# EAGLE schematic PDM_2019_RevA (EAGLE 9.1.3)

## Sheet 1 of 4
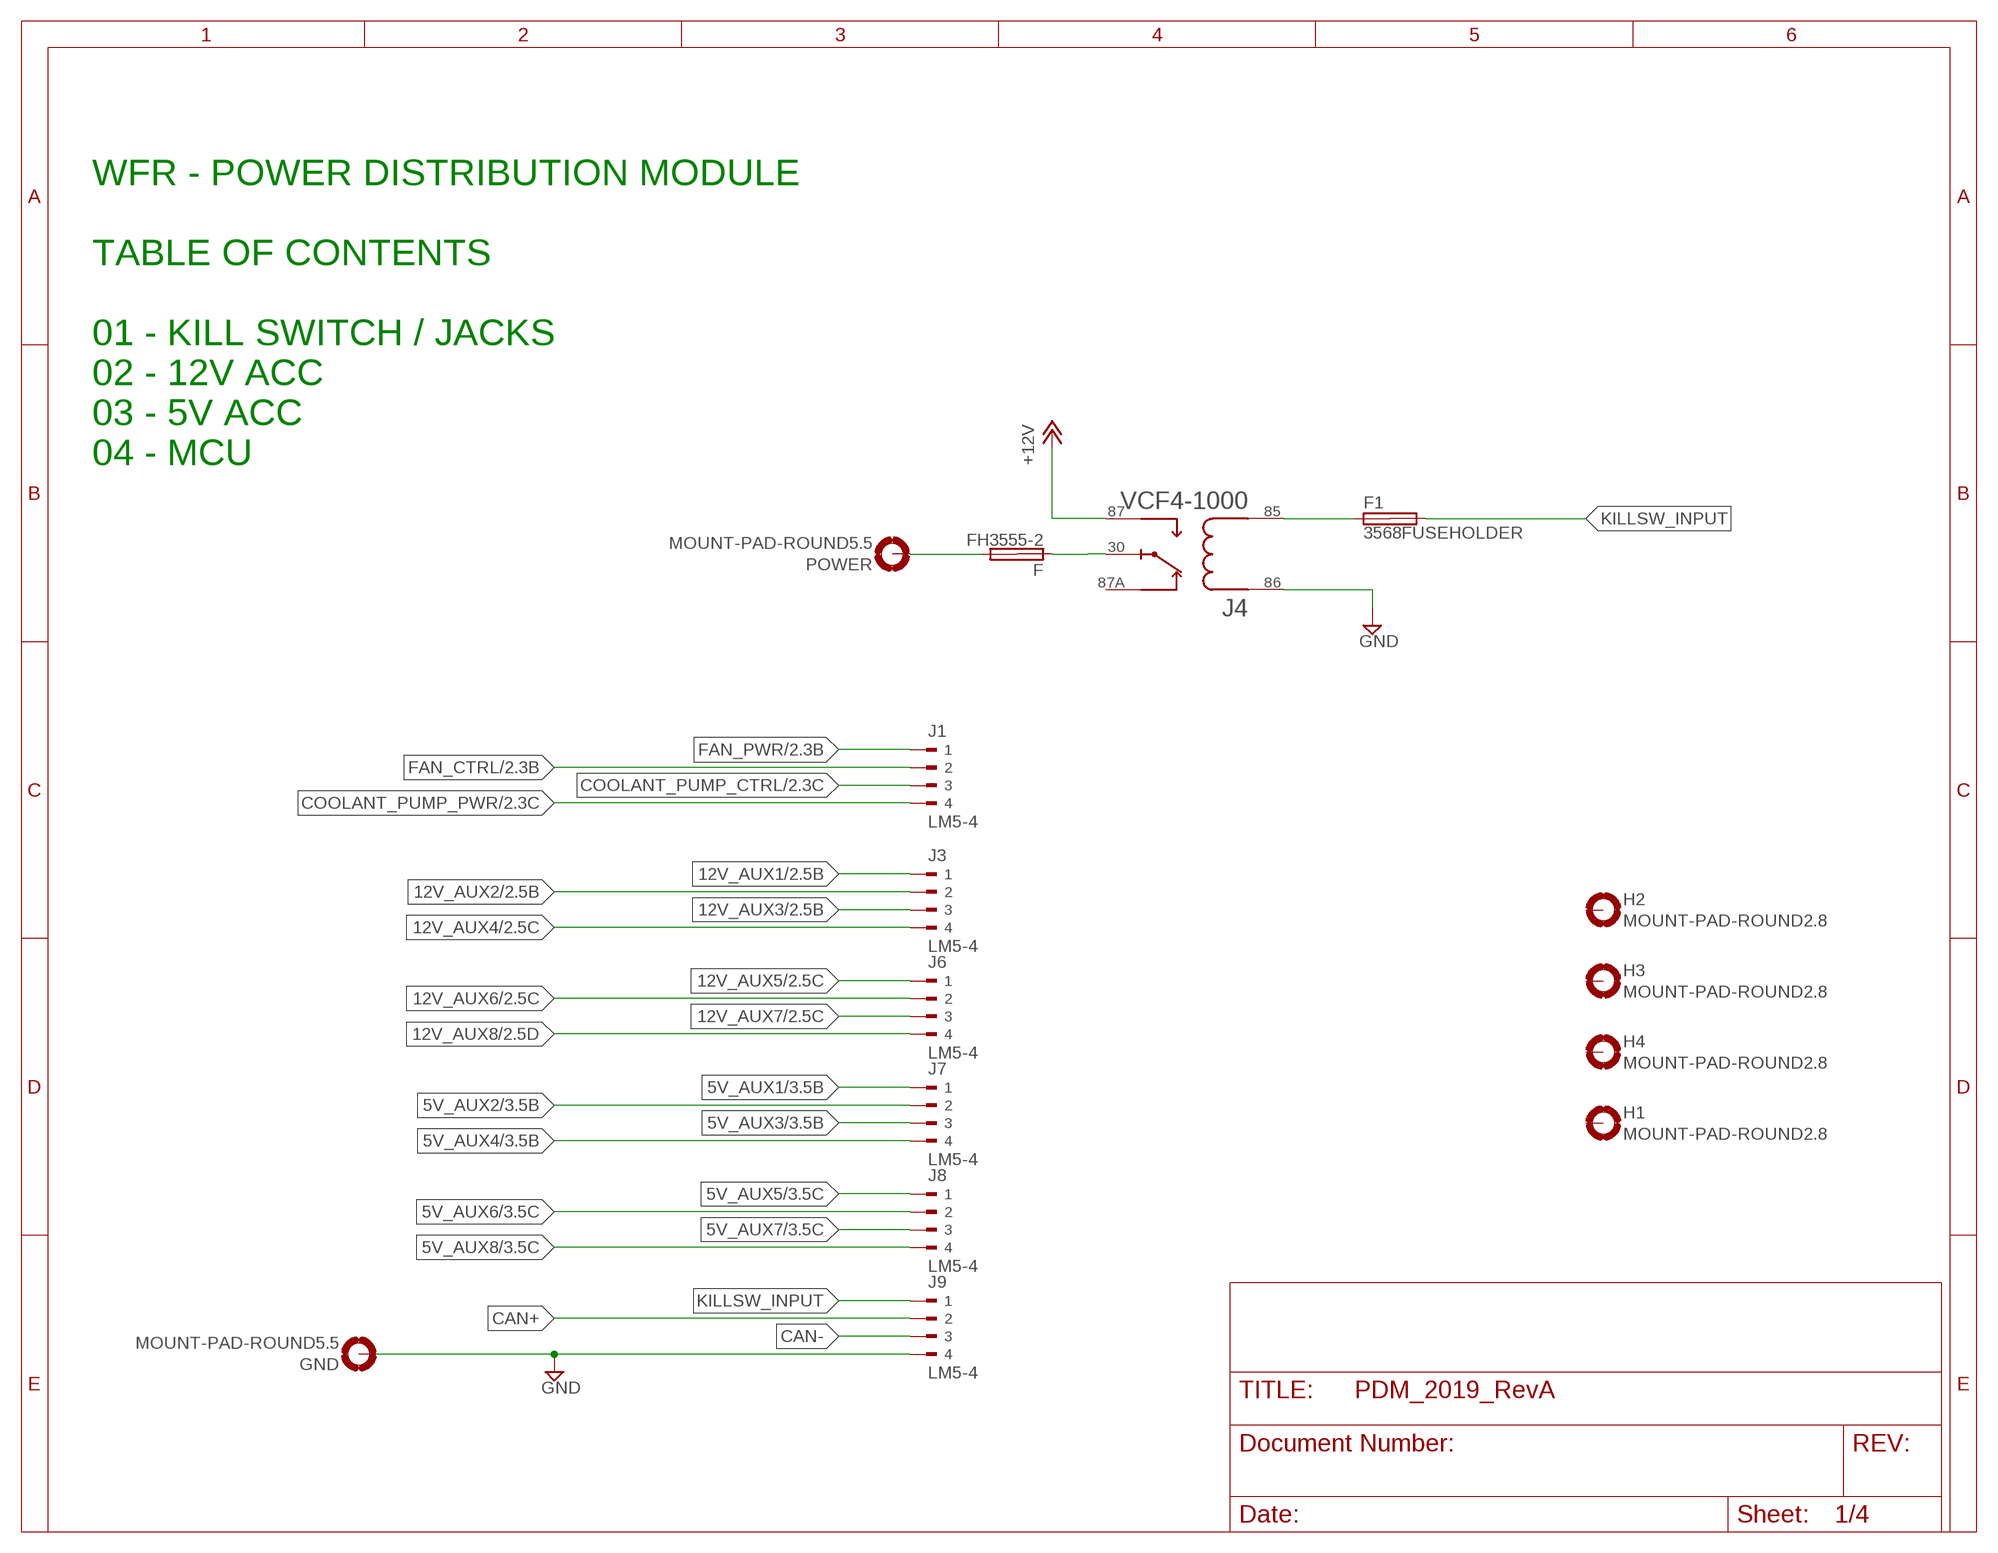
[diagram p0: schematic, sheet 1]

### Parts
F  FH3555-2  [3555-2]
F1  3568FUSEHOLDER  [3568]
GND  MOUNT-PAD-ROUND5.5  [5,5-PAD]
H1  MOUNT-PAD-ROUND2.8  [2,8-PAD]
H2  MOUNT-PAD-ROUND2.8  [2,8-PAD]
H3  MOUNT-PAD-ROUND2.8  [2,8-PAD]
H4  MOUNT-PAD-ROUND2.8  [2,8-PAD]
J1  LM5-4  [281-1423]
J3  LM5-4  [281-1423]
J4  VCF4-1000  [TE_VCF4-1000]
J6  LM5-4  [281-1423]
J7  LM5-4  [281-1423]
J8  LM5-4  [281-1423]
J9  LM5-4  [281-1423]
POWER  MOUNT-PAD-ROUND5.5  [5,5-PAD]

### Nets
5V_AUX1: J7.P$1 ; also sheet 3
5V_AUX2: J7.P$2 ; also sheet 3
5V_AUX3: J7.P$3 ; also sheet 3
5V_AUX4: J7.P$4 ; also sheet 3
5V_AUX5: J8.P$1 ; also sheet 3
5V_AUX6: J8.P$2 ; also sheet 3
5V_AUX7: J8.P$3 ; also sheet 3
5V_AUX8: J8.P$4 ; also sheet 3
12V_AUX1: J3.P$1 ; also sheet 2
12V_AUX2: J3.P$2 ; also sheet 2
12V_AUX3: J3.P$3 ; also sheet 2
12V_AUX4: J3.P$4 ; also sheet 2
12V_AUX5: J6.P$1 ; also sheet 2
12V_AUX6: J6.P$2 ; also sheet 2
12V_AUX7: J6.P$3 ; also sheet 2
12V_AUX8: J6.P$4 ; also sheet 2
+12V: J4.87 ; also sheet 2,3
CAN+: J9.P$2
CAN-: J9.P$3
COOLANT_PUMP_CTRL: J1.P$3 ; also sheet 2
COOLANT_PUMP_PWR: J1.P$4 ; also sheet 2
FAN_CTRL: J1.P$2 ; also sheet 2
FAN_PWR: J1.P$1 ; also sheet 2
GND: GND.B5,5(MOUNT) J4.86 J9.P$4 ; also sheet 2,3
KILLSW_INPUT: F1.R1(2A) J9.P$1
N$6: F1.L1(1A) J4.85
N$7: F.L1(1A) J4.30
N$8: F.R1(2A) POWER.B5,5(MOUNT)
Unconnected: F1.L2(1B) F1.R2(2B) F.L2(1B) F.R2(2B) H1.B2,8(MOUNT) H2.B2,8(MOUNT) H3.B2,8(MOUNT) H4.B2,8(MOUNT) J4.87A

### Notes on the sheet
- WFR - POWER DISTRIBUTION MODULE
  
  TABLE OF CONTENTS
  
  01 - KILL SWITCH / JACKS
  02 - 12V ACC
  03 - 5V ACC
  04 - MCU

## Sheet 2 of 4
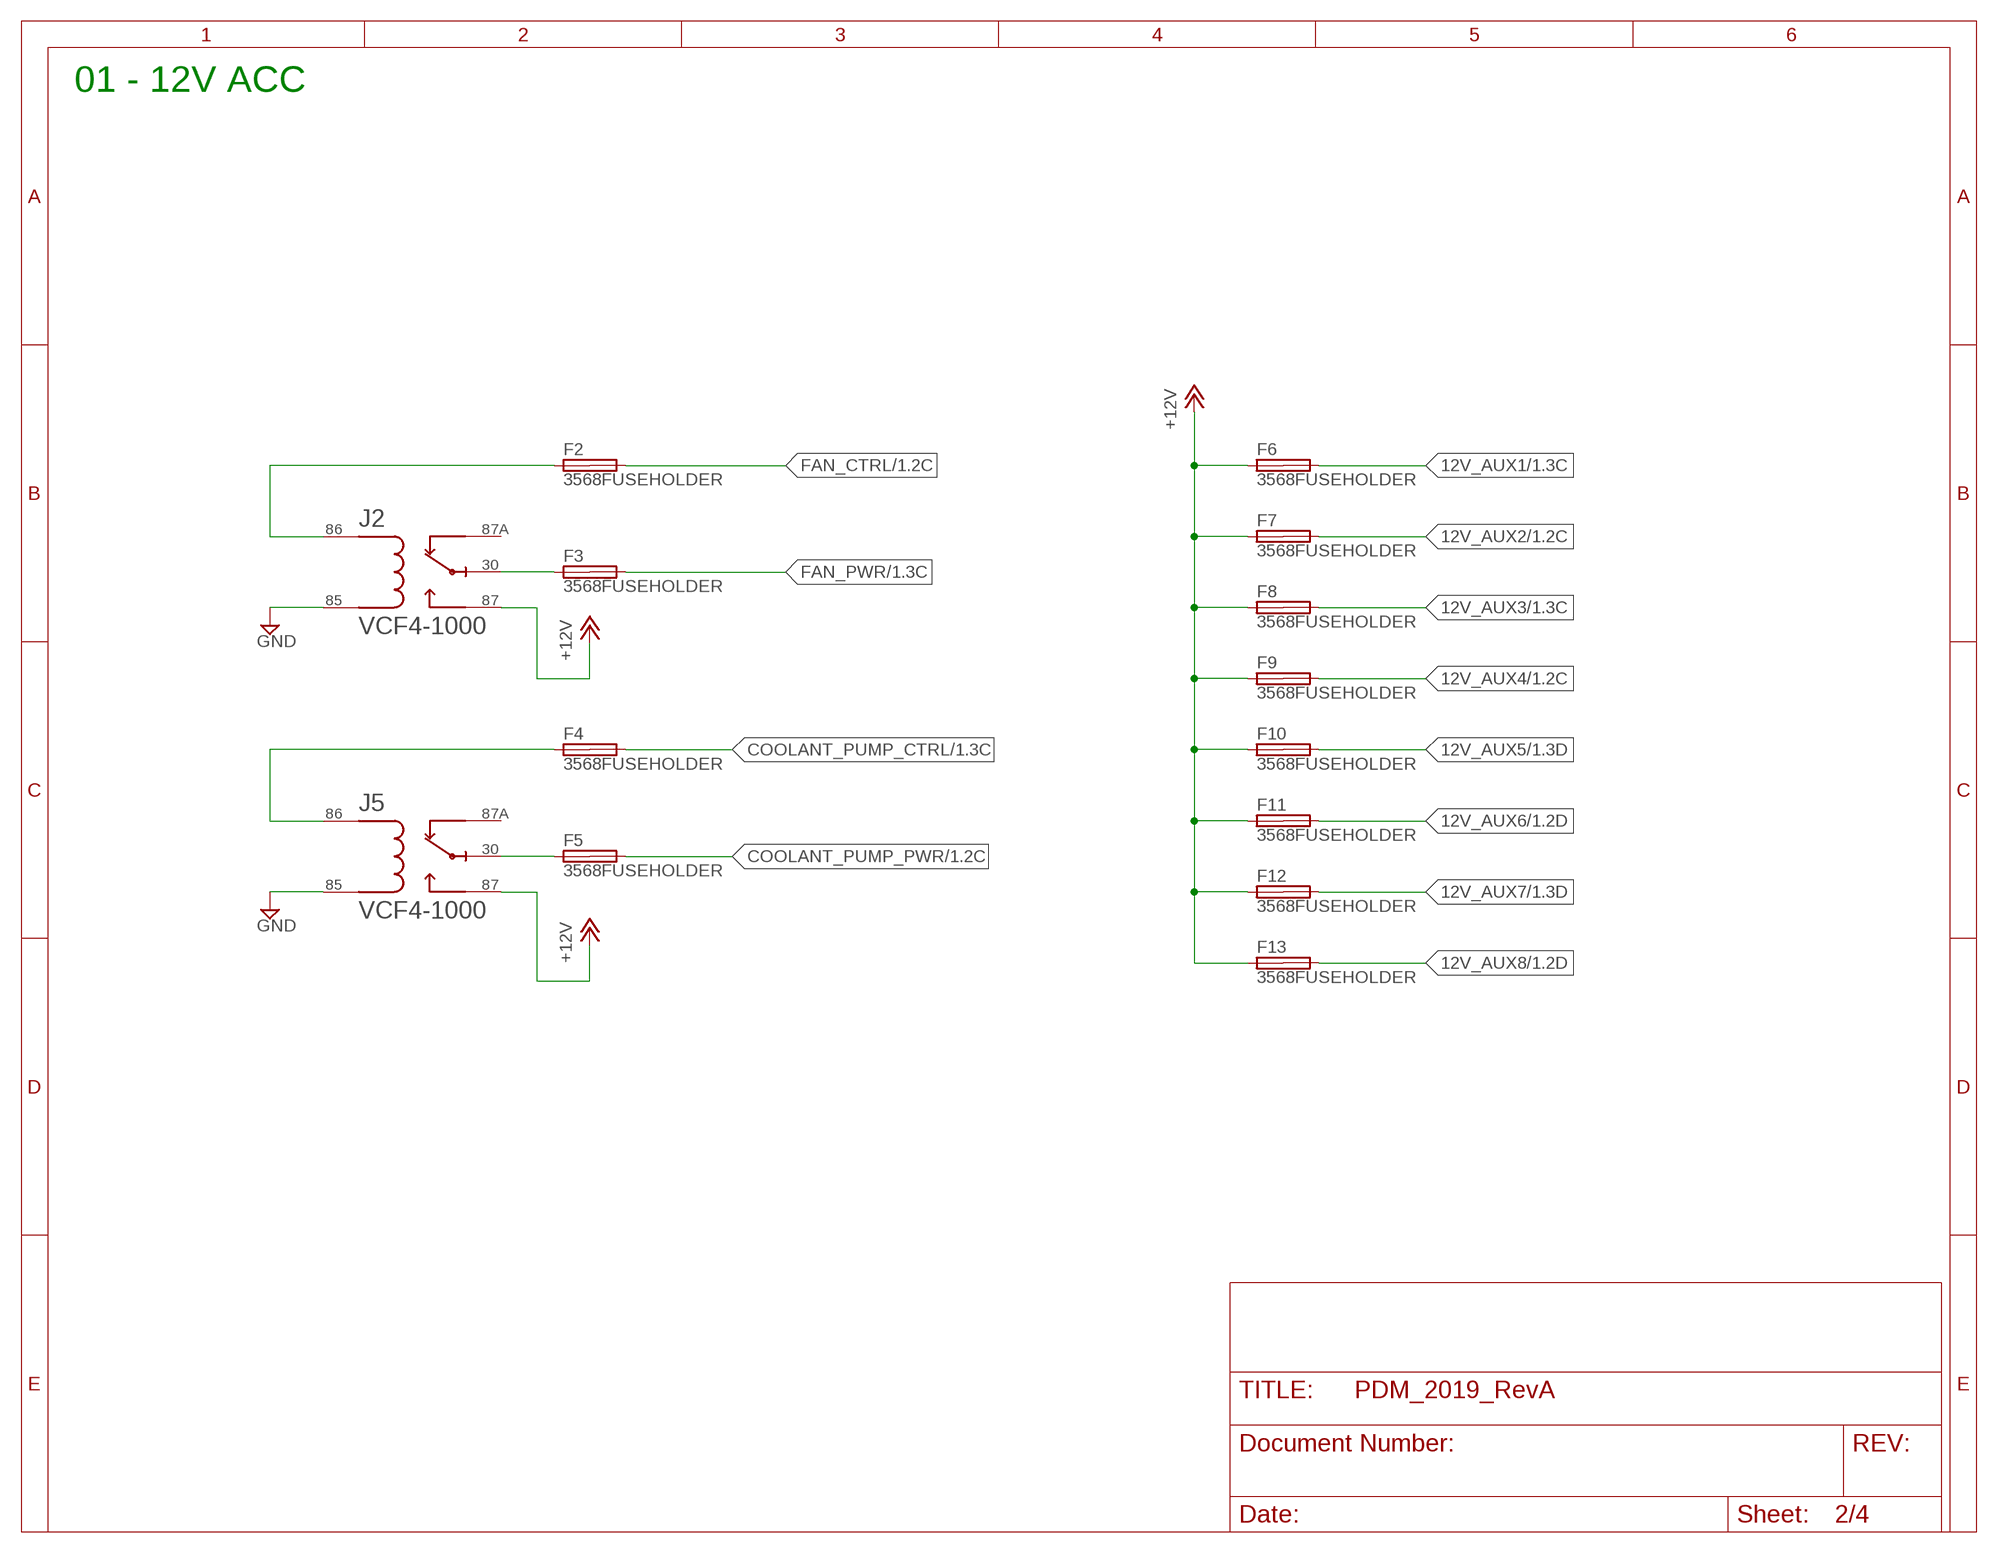
[diagram p1: schematic, sheet 2]

### Parts
F2  3568FUSEHOLDER  [3568]
F3  3568FUSEHOLDER  [3568]
F4  3568FUSEHOLDER  [3568]
F5  3568FUSEHOLDER  [3568]
F6  3568FUSEHOLDER  [3568]
F7  3568FUSEHOLDER  [3568]
F8  3568FUSEHOLDER  [3568]
F9  3568FUSEHOLDER  [3568]
F10  3568FUSEHOLDER  [3568]
F11  3568FUSEHOLDER  [3568]
F12  3568FUSEHOLDER  [3568]
F13  3568FUSEHOLDER  [3568]
J2  VCF4-1000  [TE_VCF4-1000]
J5  VCF4-1000  [TE_VCF4-1000]

### Nets
12V_AUX1: F6.R1(2A) ; also sheet 1
12V_AUX2: F7.R1(2A) ; also sheet 1
12V_AUX3: F8.R1(2A) ; also sheet 1
12V_AUX4: F9.R1(2A) ; also sheet 1
12V_AUX5: F10.R1(2A) ; also sheet 1
12V_AUX6: F11.R1(2A) ; also sheet 1
12V_AUX7: F12.R1(2A) ; also sheet 1
12V_AUX8: F13.R1(2A) ; also sheet 1
+12V: F6.L1(1A) F7.L1(1A) F8.L1(1A) F9.L1(1A) F10.L1(1A) F11.L1(1A) F12.L1(1A) F13.L1(1A) J2.87 J5.87 ; also sheet 1,3
COOLANT_PUMP_CTRL: F4.R1(2A) ; also sheet 1
COOLANT_PUMP_PWR: F5.R1(2A) ; also sheet 1
FAN_CTRL: F2.R1(2A) ; also sheet 1
FAN_PWR: F3.R1(2A) ; also sheet 1
GND: J2.85 J5.85 ; also sheet 1,3
N$5: F2.L1(1A) J2.86
N$9: F3.L1(1A) J2.30
N$10: F4.L1(1A) J5.86
N$11: F5.L1(1A) J5.30
Unconnected: F2.L2(1B) F2.R2(2B) F3.L2(1B) F3.R2(2B) F4.L2(1B) F4.R2(2B) F5.L2(1B) F5.R2(2B) F6.L2(1B) F6.R2(2B) F7.L2(1B) F7.R2(2B) F8.L2(1B) F8.R2(2B) F9.L2(1B) F9.R2(2B) F10.L2(1B) F10.R2(2B) F11.L2(1B) F11.R2(2B) F12.L2(1B) F12.R2(2B) F13.L2(1B) F13.R2(2B) J2.87A J5.87A

### Notes on the sheet
- 01 - 12V ACC

## Sheet 3 of 4
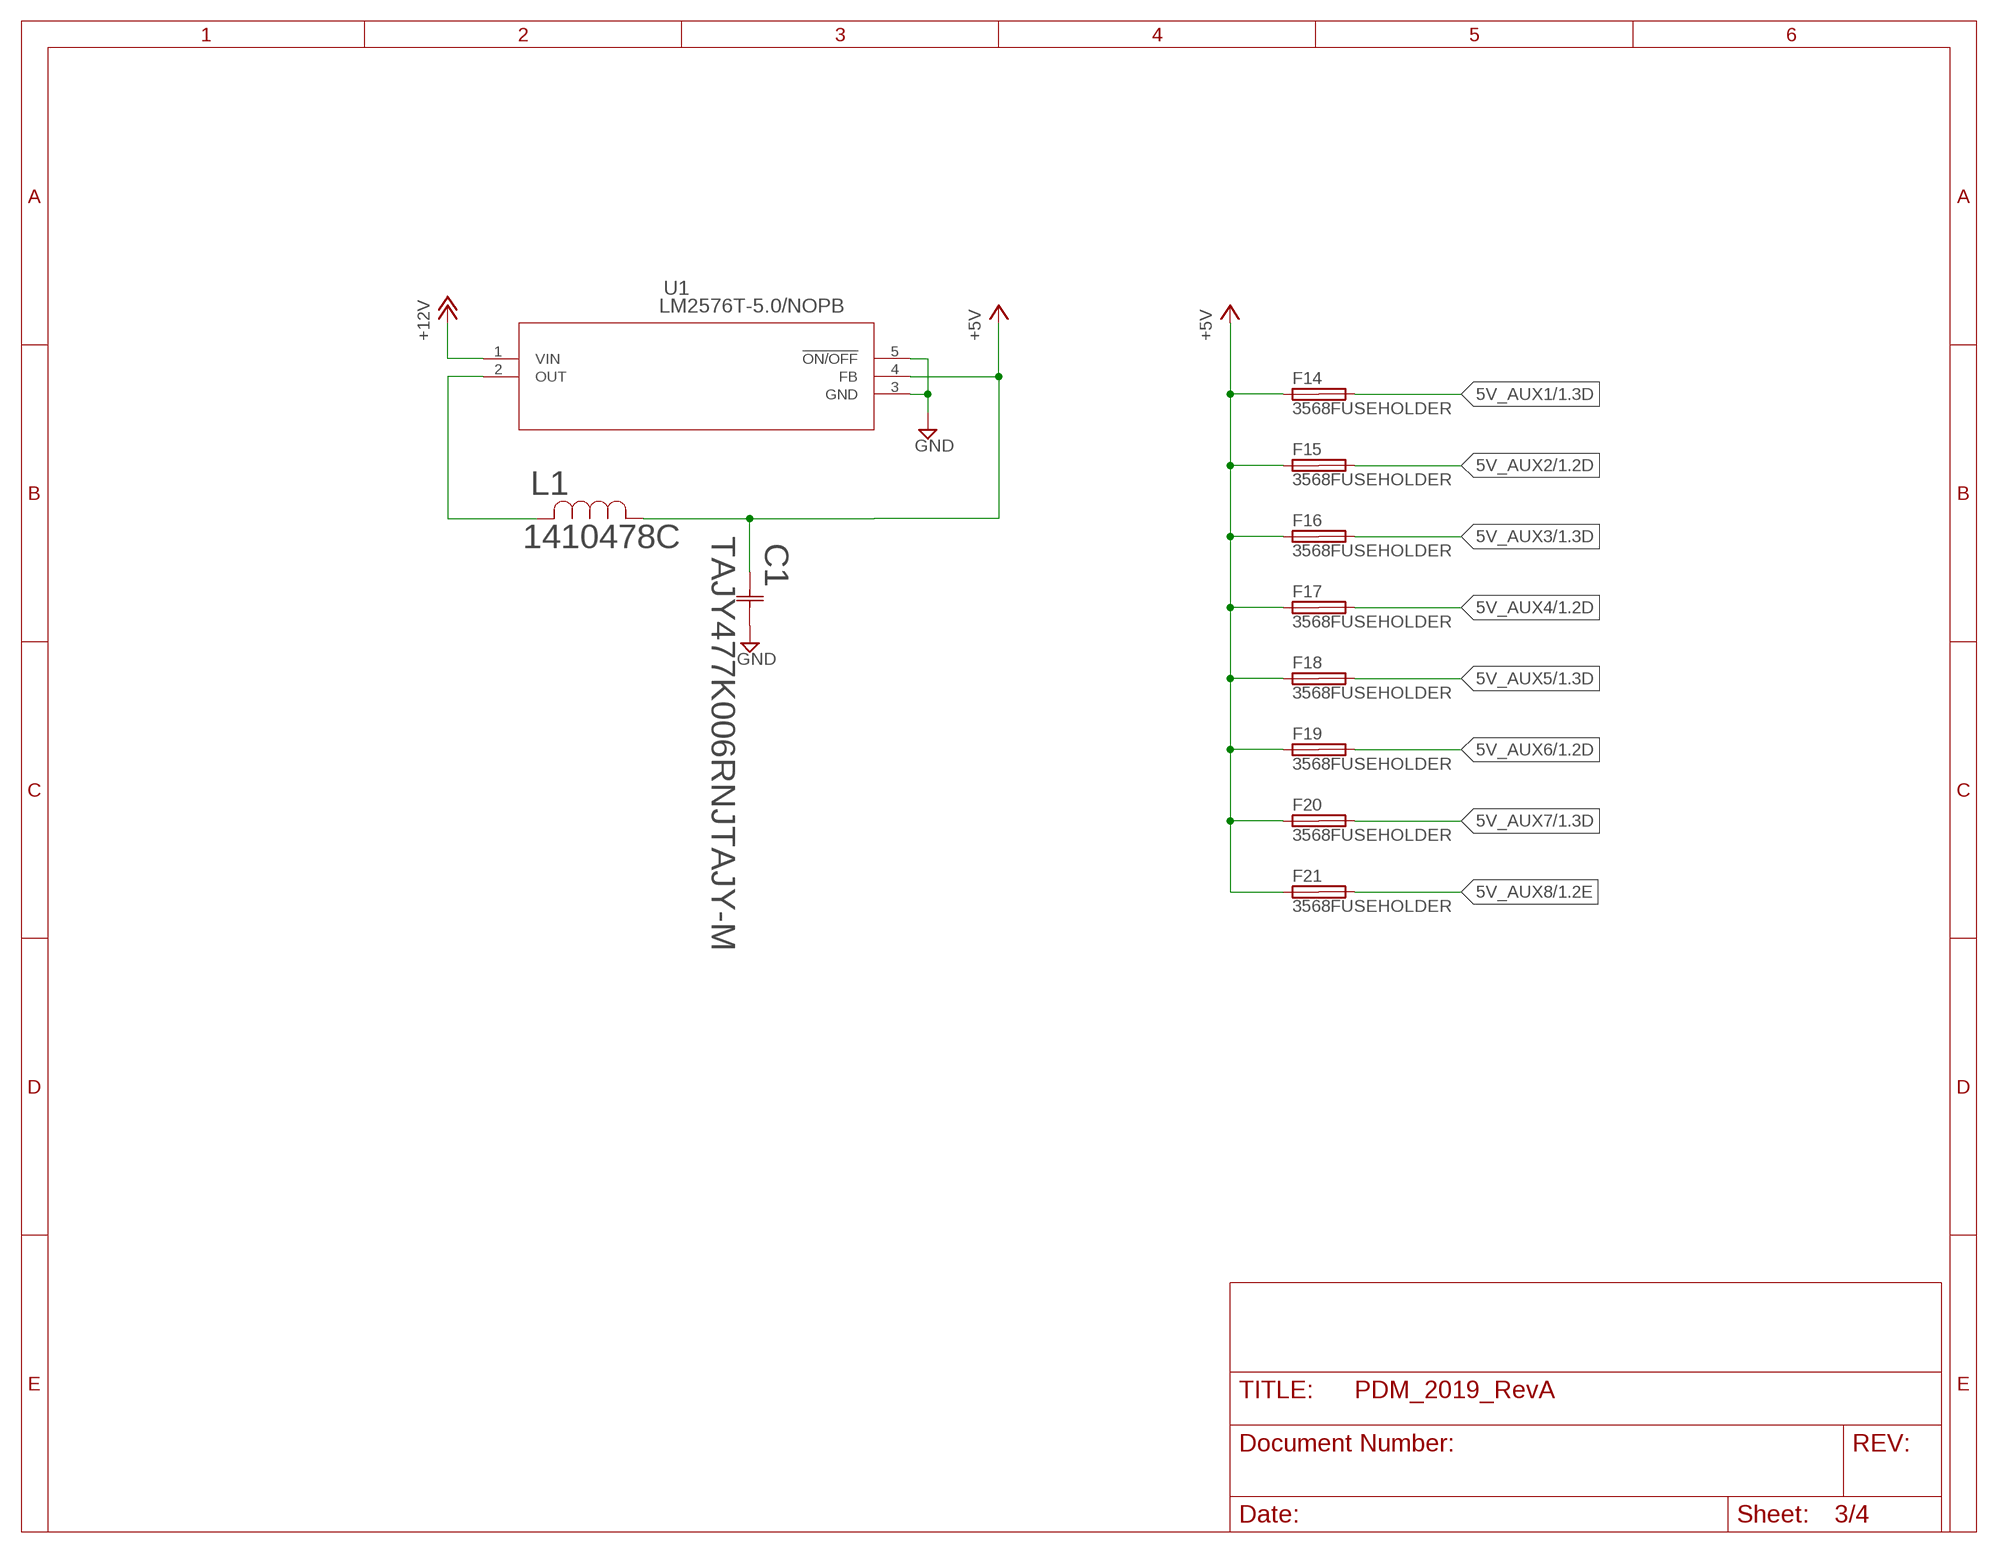
[diagram p2: schematic, sheet 3]

### Parts
C1  TAJY477K006RNJTAJY-M  [TAJY-M]
F14  3568FUSEHOLDER  [3568]
F15  3568FUSEHOLDER  [3568]
F16  3568FUSEHOLDER  [3568]
F17  3568FUSEHOLDER  [3568]
F18  3568FUSEHOLDER  [3568]
F19  3568FUSEHOLDER  [3568]
F20  3568FUSEHOLDER  [3568]
F21  3568FUSEHOLDER  [3568]
L1  1410478C  [1410478C]
U1  LM2576T-5.0/NOPB  [T05A]

### Nets
5V_AUX1: F14.R1(2A) ; also sheet 1
5V_AUX2: F15.R1(2A) ; also sheet 1
5V_AUX3: F16.R1(2A) ; also sheet 1
5V_AUX4: F17.R1(2A) ; also sheet 1
5V_AUX5: F18.R1(2A) ; also sheet 1
5V_AUX6: F19.R1(2A) ; also sheet 1
5V_AUX7: F20.R1(2A) ; also sheet 1
5V_AUX8: F21.R1(2A) ; also sheet 1
+5V: C1.1 F14.L1(1A) F15.L1(1A) F16.L1(1A) F17.L1(1A) F18.L1(1A) F19.L1(1A) F20.L1(1A) F21.L1(1A) L1.1 U1.4(FB)
+12V: U1.1(VIN) ; also sheet 1,2
GND: C1.2 U1.3(GND) U1.5(!ON/OFF) ; also sheet 1,2
N$1: L1.2 U1.2(OUT)
Unconnected: F14.L2(1B) F14.R2(2B) F15.L2(1B) F15.R2(2B) F16.L2(1B) F16.R2(2B) F17.L2(1B) F17.R2(2B) F18.L2(1B) F18.R2(2B) F19.L2(1B) F19.R2(2B) F20.L2(1B) F20.R2(2B) F21.L2(1B) F21.R2(2B)

## Sheet 4 of 4
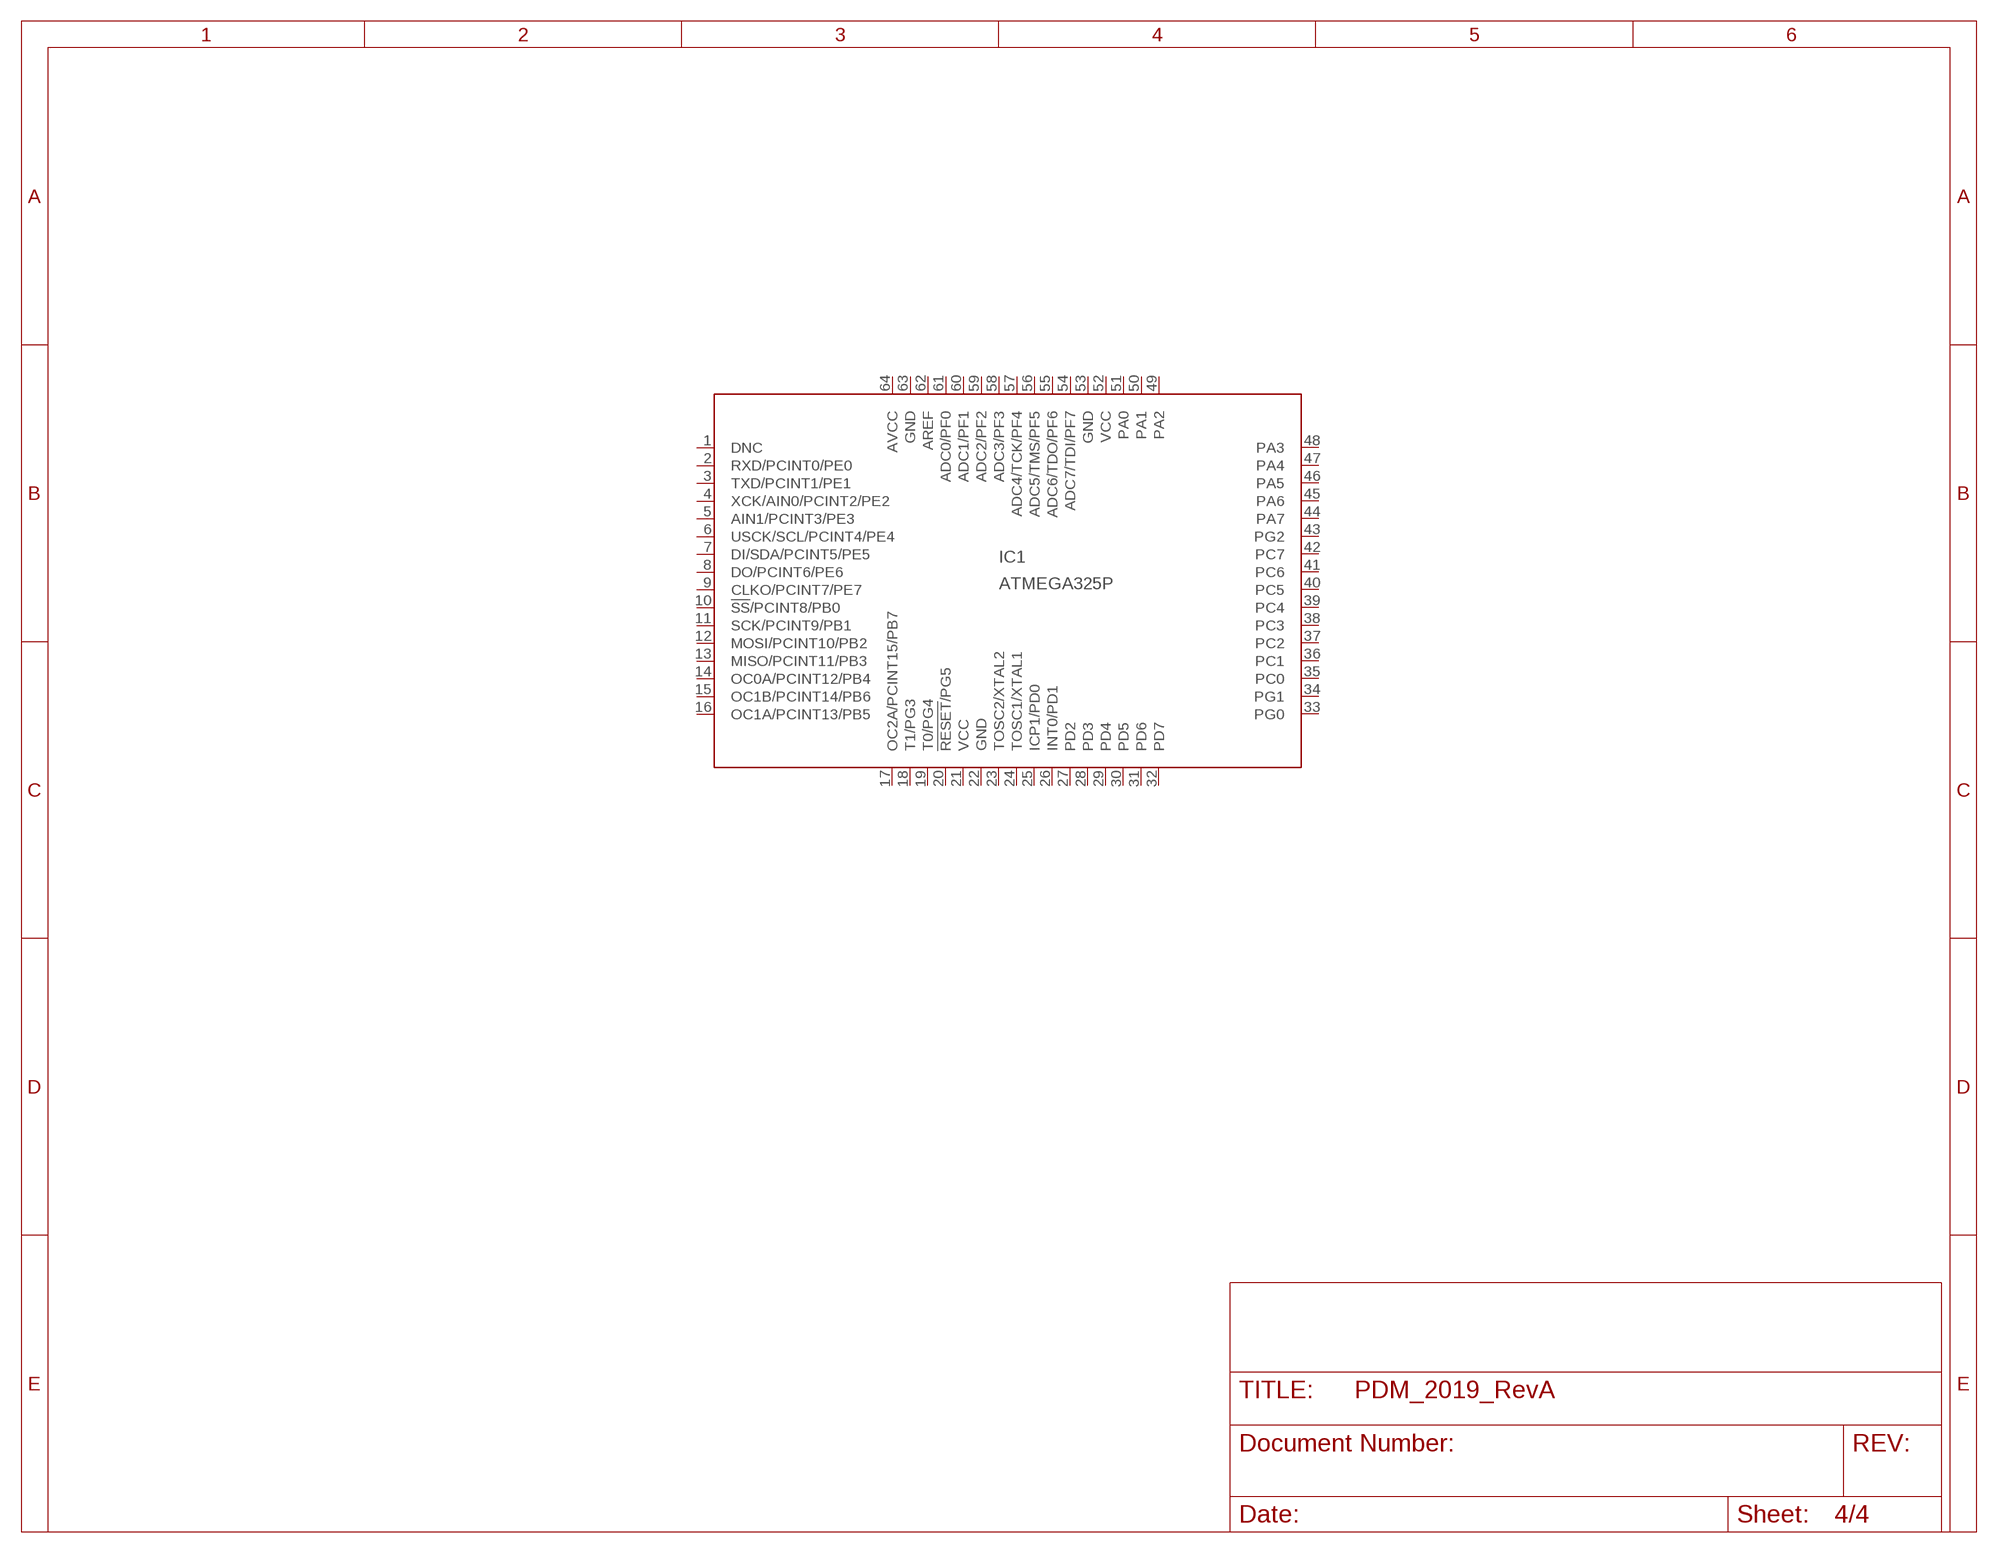
[diagram p3: schematic, sheet 4]

### Parts
IC1  ATMEGA325P  [64M1]
Unconnected: IC1.1(DNC) IC1.2(RXD/PCINT0/PE0) IC1.3(TXD/PCINT1/PE1) IC1.4(XCK/AIN0/PCINT2/PE2) IC1.5(AIN1/PCINT3/PE3) IC1.6(USCK/SCL/PCINT4/PE4) IC1.7(DI/SDA/PCINT5/PE5) IC1.8(DO/PCINT6/PE6) IC1.9(CLKO/PCINT7/PE7) IC1.10(!SS!/PCINT8/PB0) IC1.11(SCK/PCINT9/PB1) IC1.12(MOSI/PCINT10/PB2) IC1.13(MISO/PCINT11/PB3) IC1.14(OC0A/PCINT12/PB4) IC1.15(OC1B/PCINT14/PB6) IC1.16(OC1A/PCINT13/PB5) IC1.17(OC2A/PCINT15/PB7) IC1.18(T1/PG3) IC1.19(T0/PG4) IC1.20(!RESET!/PG5) IC1.23(TOSC2/XTAL2) IC1.24(TOSC1/XTAL1) IC1.25(ICP1/PD0) IC1.26(INT0/PD1) IC1.27(PD2) IC1.28(PD3) IC1.29(PD4) IC1.30(PD5) IC1.31(PD6) IC1.32(PD7) IC1.33(PG0) IC1.34(PG1) IC1.35(PC0) IC1.36(PC1) IC1.37(PC2) IC1.38(PC3) IC1.39(PC4) IC1.40(PC5) IC1.41(PC6) IC1.42(PC7) IC1.43(PG2) IC1.44(PA7) IC1.45(PA6) IC1.46(PA5) IC1.47(PA4) IC1.48(PA3) IC1.49(PA2) IC1.50(PA1) IC1.51(PA0) IC1.54(ADC7/TDI/PF7) IC1.55(ADC6/TDO/PF6) IC1.56(ADC5/TMS/PF5) IC1.57(ADC4/TCK/PF4) IC1.58(ADC3/PF3) IC1.59(ADC2/PF2) IC1.60(ADC1/PF1) IC1.61(ADC0/PF0) IC1.62(AREF)

## Power pins joined to a net without a drawn wire
AVCC: IC1.64(AVCC)
GND: IC1.22(GND) IC1.53(GND) IC1.63(GND)
VCC: IC1.21(VCC) IC1.52(VCC)

## Library data of the parts
C1 = TAJY477K006RNJ:TAJY477K006RNJ; MANUFACTURER_PART_NUMBER: TAJY477K006RNJ; VENDOR: AVX Corporation
F = fuse:FH3555-2
F1-F21 = fuse:3568FUSEHOLDER: 3568 20AMP 500VAC
GND H1-H4 POWER = holes:MOUNT-PAD-ROUND: MOUNTING PAD, round
IC1 = atmel:ATMEGA325P: 8-bit Microcontroller with 32K Bytes In-System Programmable Flash Source: http://www.atmel.com .. doc8023.pdf; MPN: ATMEGA325PV-10AU; OC_FARNELL: 1636939; OC_NEWARK: 03P2025
J1 J3 J6-J9 = con-weidmueller-sl35:LM5-4
J2 J4 J5 = VCF4-1000:VCF4-1000: Socket, Relay; PCB, VTF Series, 1 Pole, Quick-Connect, w/o Grounding Provision; COMMENT: VCF4-1000 _1393310-3_; DESCRIPTION: VCF4-1000=FROM SEC; DIGI-KEY_PART_NUMBER: PB232-ND; DIGI-KEY_PURCHASE_URL: https://www.digikey.ca/product-detail/en/te-connectivity-potter-brumfield-relays/VCF4-1000/PB232-ND/207273?utm_source=snapeda&utm_medium=aggregator&utm_campaign=symbol; MF: TE Connectivity; MP: VCF4-1000; PACKAGE: None; PRODUCT_TYPE: Socket
L1 = 1410478C:1410478C; MANUFACTURER_PART_NUMBER: 1410478C; VENDOR: Murata
U1 = LM2576T:LM2576T-5.0/NOPB; MANUFACTURER_PART_NUMBER: LM2576T5.0NOPB; VENDOR: Texas Instruments

## Net classes
0 LO RAIL: width 4.24 mm, drill 0.5 mm, clearance 0.2 mm
1 HIGH RAIL: width 9.55 mm, drill 0.5 mm, clearance 0.2 mm
2 SIG: width 0.13 mm, drill 0.5 mm, clearance 0.2 mm
3 30Rail: width 5.2 mm, drill 0.5 mm, clearance 0.2 mm